# Altium schematic sheet Esquematico fonte 3.3V.SchDoc
size A4; SheetNumber: 1; SheetTotal: 1
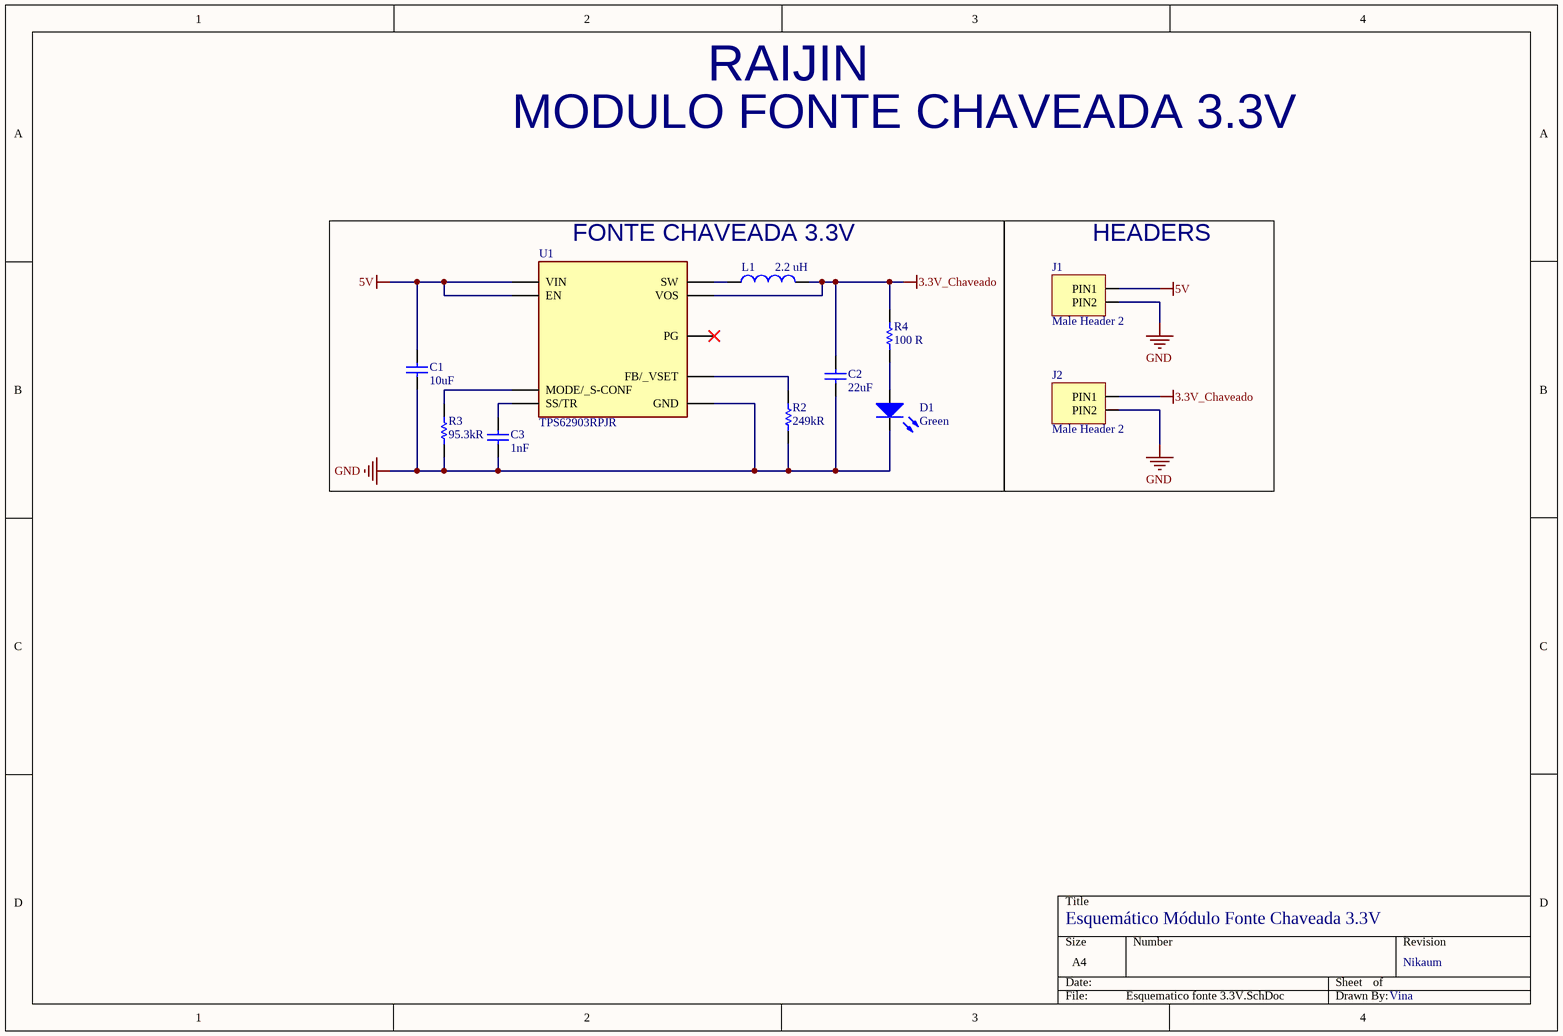
[diagram p0: Esquematico fonte 3.3V.SchDoc]

## Parts
C1  10uF  [C0805]
C2  22uF  [C0603]
C3  1nF  [C0402]
D1  Green  [LED_0603]
J1  Male Header 2  [MALE HEADER 2]
J2  Male Header 2  [MALE HEADER 2]
L1  2.2 uH  [XAL0402]
R2  249kR  [RESISTOR_0805]
R3  95.3kR  [RESISTOR_0402]
R4  100 R  [RESISTOR_0603]
U1  TPS62903RPJR  [VQFN-HR-9]

## Blocks framed on the sheet
FONTE CHAVEADA 3.3V: C1-C3 D1 L1 R2-R4 U1
HEADERS: J1 J2

## Nets
3.3V_Chaveado: C2.2 J2.PIN1 L1.2 R4.2 U1.VOS
5V: C1.2 J1.PIN1 U1.EN U1.VIN
GND: C1.1 C2.1 C3.1 D1.C J1.PIN2 J2.PIN2 R2.1 R3.1 U1.GND
NetC3_2: C3.2 U1.SS(SS/TR)
NetD1_A: D1.A R4.1
NetL1_1: L1.1 U1.SW
NetR2_2: R2.2 U1.FB(FB/_VSET)
NetR3_2: R3.2 U1.MODE(MODE/_S-CONF)

Not connected (* = marked no-connect by the designer): U1 PG*

## Notes on the sheet
- RAIJIN
- MODULO FONTE CHAVEADA 3.3V
- Esquemático Módulo Fonte Chaveada 3.3V
- Nikaum
- Vina

## Library data of the parts
C1 = C0805C106K8PACTU: CAP CER 10uF 10V 10% X5R 0805; Manufacturer: KEMET; ESR: 3mR; Library Control - Person that did the Last Update Footprint: Marcos; Supplier 1: Mouser; Part Number: C0805C106K8PACTU; Category: Cereamic Capacitor; Price: 1=0,95, 10=0,632, 100=0,397, 1000=0,322 (USD); Supplier Part Number 1: 80-C0805C106K8P; Library Ref: Capacitor; Operating Temperature: -55 C ~ 85 C; Package / Case: 0805(2012 Metric); Size / Dimension: 2 L x 1,25 W x 1,25 H; Tolerance: 10%; Value: 10uF; Voltage - Rated: 10V; Dieletric: X5R; Library Control - Checked Footprint: -; Library Control - Checked Schematic: -; Library Control - Last Project that Used: -; Library Control - Last Update: 14/07/2021 13:54; Library Control - Person that Checked Footprint: -; Library Control - Person that Checked Schematic: -; Library Control - Person that did the Last Update Schematic: Marcos; ComponentLink1Description: Datasheet; ComponentLink1URL: https://www.mouser.com/datasheet/2/212/KEM_C1006_X5R_SMD-1103249.pdf; ComponentLink2Description: Mouser Link; ComponentLink2URL: https://www.mouser.com/ProductDetail/KEMET/C0805C106K8PACTU?qs=Zpyg6gQUYs39C21BeavaKA%3D%3D
C2 = F980J226MMA: CAP TAN 22uF 6.3V 0603; Manufacturer: AVX; Tolerance: 20%; ESR: 6 Ohms; Dieletric: Tantalum; Library Control - Checked Footprint: Yes; Library Control - Person that Checked Footprint: Nikaum; Supplier 1: Mouser; Part Number: F980J226MMA; Category: Tantalum Capacitor; Price: 1 = 0,68, 10=0,478, 100=0,315 (USD); Supplier Part Number 1: 647-F980J226MMA; Library Ref: Capacitor; Operating Temperature: -55 C ~ 125 C; Package / Case: 0603 (1608 Metric); Size / Dimension: 1,60 L x 0,85 W x 0,80 H; Value: 22uF; Voltage - Rated: 6.3V; Library Control - Checked Schematic: Yes; Library Control - Last Update: 27/06/2021 23:58; Library Control - Person that Checked Schematic: Nikaum; Library Control - Person that did the Last Update Footprint: Nikaum; Library Control - Person that did the Last Update Schematic: Nikaum; ComponentLink1Description: Datasheet; ComponentLink1URL: https://br.mouser.com/datasheet/2/40/AVX_F98%20DTSH%2008_16-1158749.pdf; ComponentLink2Description: Mouser Link; ComponentLink2URL: https://br.mouser.com/ProductDetail/AVX/F980J226MMA?qs=%2Fha2pyFadujX%2FtPo6us3LKqC08nSC7LuR55MTleiyuYwEisNTuy1Qg%3D%3D
C3 = GRM155R61A102KA01D: CAP CER 1nF 10V 10% X5R 0402; Manufacturer: Murata; Voltage - Rated: 10 VDC; ESR: 1mR; Library Control - Person that did the Last Update Footprint: Marcos; Supplier 1: Mouser; Part Number: GRM155R61A102KA01D; Category: Cereamic Capacitor; Price: 1=0,10, 10=0,029, 100=0,013, 1000=0,007 (USD); Supplier Part Number 1: 81-GRM155R61A102KA1D; Library Ref: Capacitor; Operating Temperature: -55 C ~ 85 C; Package / Case: 0402 (1005 Metric); Size / Dimension: 1 L x 0,5 W x 0,5 H; Tolerance: 10%; Value: 1nF; Dieletric: X5R; Library Control - Checked Footprint: -; Library Control - Checked Schematic: -; Library Control - Last Project that Used: -; Library Control - Last Update: 14/07/2021 14:02; Library Control - Person that Checked Footprint: -; Library Control - Person that Checked Schematic: -; Library Control - Person that did the Last Update Schematic: Marcos; ComponentLink1Description: Datasheet; ComponentLink1URL: https://www.mouser.com/datasheet/2/281/1/GRM155R61A102KA01_01A-1983865.pdf; ComponentLink2Description: Mouser Link; ComponentLink2URL: https://www.mouser.com/ProductDetail/Murata-Electronics/GRM155R61A102KA01D?qs=%2Fha2pyFadugsr51Fgcs3VAawZYh8F95Q8wbZYWKEskhTBdNn7s5FlndoImKM8CcX
D1 = 150060VS75000: LED 0.072W GREEN 40MCD 0603; Manufacturer: Wurth Elektronik; Current - Forward (If): 20 mA; Voltage - Forward (Vf): 2 V; Viewing Angle: 140°; Wavelength: 570nm; Max Power Dissipation: 72mW; Max Current Rating: 100mA; Reverse Voltage:: 5V; Library Control - Last Project that Used: Diodo/Led; Library Control - Person that Checked Footprint: Stéfany (Ster); Library Control - Person that did the Last Update Schematic: Marcos; Supplier 1: Mouser; Part Number: 150060VS75000; Category: Standard LEDs - SMD; Price: 1 = 0.14, 50 = 0.133, 100 = 0.114 (USD); Package / Case: 0603; Color: Green; Operating Temperature: -40~85 °C; Luminous Intensity: 40 mcd; Library Ref: LED; Supplier Part Number 1: 710-150060VS75000; Library Control - Checked Footprint: 25/07/2021; Library Control - Checked Schematic: 25/07/2021; Library Control - Last Update: 09/09/2021 16:12; Library Control - Person that Checked Schematic: Stéfany (Ster); Library Control - Person that did the Last Update Footprint: Stéfany (Ster); ComponentLink1Description: Mouser Link; ComponentLink1URL: https://br.mouser.com/ProductDetail/Wurth-Elektronik/150060VS75000?qs=%2Fha2pyFaduhuT%2FKGSijZP0vTyJZ9U993KfsBQSxqATYhY9jnc2c09tXoMoJ3wn4L; ComponentLink2Description: Datasheet Link; ComponentLink2URL: https://br.mouser.com/datasheet/2/445/150060VS75000-1714627.pdf
J1 J2 = Male Header 2: Number of Contacts: 2; Library Control - Person that did the Last Update Schematic: Marcos; System: Connector; Library Ref: Header; Library Control - Checked Footprint: *; Library Control - Checked Schematic: *; Library Control - Last Project that Used: *; Library Control - Last Update: *; Library Control - Person that Checked Footprint: *; Library Control - Person that Checked Schematic: *; Library Control - Persont that did the Last Update Footprint: Marcos
L1 = XAL4020-222MEB: IND FIX 2.2uH Shld 20% 5.5A 38.7mOhms AECQ2; Manufacturer: Coilcraft; Part Number: XAL5030-332MEB; Inductance Frequency - Test: 1 MHz; Material - Core: Composite; Shielding: Shielded; Type: Fixed; Library Control - Checked Footprint: Yes; Library Control - Person that Checked Footprint: Nikaum; Category: Fixed Inductors; Current Rating (Amps): 5.5 A; DC Resistance (DCR): 38.7 mOhms; Frequency - Self Resonant: -; Library Ref: Inductor; Operating Temperature: - 40C ~ 125C; Package / Case: SMD/SMT; Price: 1=1,76, 10=1,75, 100=1,66 (USD); Q @ Freq: -; Size / Dimension: 4.3 mm x 4.3 mm x 2.1 mm; Supplier 1: Mouser; Supplier Part Number 1: 994-XAL4020-222MEB; Tolerance: 20 %; Value: 2.2 uH; Library Control - Last Project that Used: -; Library Control - Last Update: 07/10/2021 11:22; Library Control - Person that Checked Schematic: Nikaum; ComponentLink1Description: Datasheet; ComponentLink1URL: https://br.mouser.com/datasheet/2/597/xal50xx-270657.pdf; ComponentLink2Description: Mouser Link; ComponentLink2URL: https://br.mouser.com/ProductDetail/Coilcraft/XAL5030-332MEB?qs=VJjuEbE9QBML1BhYSWqvXA%3D%3D
R2 = CRCW0805249KFKEA: RES SMD 249K OHM 1% 1/8W 0805; Manufacturer: Vishay / Dale; Temperature Coefficient: 100 PPM / C; Power Rating: 125 mW (1/8 W); Voltage Rating: 150 V; Library Control - Checked Footprint: No; Library Control - Checked Schematic: Yes; Library Control - Person that Checked Schematic: Marcos; Library Control - Person that did the Last Update Footprint: Dalarme; Supplier 1: Mouser; Part Number: CRCW0805249KFKEA; Category: Thick Film Resistors - SMD; Price: 1=0,18, 10=0,065, 100=0,027 1000=0,012 (USD); Package / Case: 0805 (2012 Metric); Operating Temperature: - 55ºC ~ 155ºC; Value: 249kR; Tolerance: 1 %; Library Ref: Resistor; Resistor Type: Fixo; Size / Dimension: 2 mm L x  1.25 mm W x  0.45 mm H; Supplier Part Number 1: 71-CRCW0805-249K-E3; Library Control - Last Update: 21/06/21 15:40; Library Control - Person that did the Last Update Schematic: Marcos; ComponentLink1Description: Mouser Link; ComponentLink1URL: https://www.mouser.com/ProductDetail/Vishay-Dale/CRCW0805249KFKEA?qs=%2Fha2pyFaduhkDOWkOJXWlGd1WMXaUgXuAgPdkVedxkHPM1mWPj6Q%2Fw%3D%3D; ComponentLink2Description: Datasheet Link; ComponentLink2URL: https://www.mouser.com/datasheet/2/427/dcrcwe3-1762152.pdf
R3 = CRCW040295K3FKED: RES SMD 95.3K OHM 1% 1/16W 0402; Manufacturer: Vishay; Temperature Coefficient: 100 PPM / C; Power Rating: 62,5mW (1/16 W); Voltage Rating: 50V; Library Control - Person that did the last Update Schematic: Marcos; Supplier 1: Mouser; Part Number: CRCW040295K3FKED; Category: Thick Film Resistors - SMD; Price: 1 = 0,11, 10=0,04, 100=0,016, 1000=0,008 (USD); Package / Case: 0402 (1005 Metric); Operating Temperature: -55 C ~ 155 C; Value: 95.3kR; Tolerance: 1 %; Library Ref: Resistor; Resistor Type: Fixo; Size / Dimension: 1 L x 0,5 W x 0,35 H; Supplier Part Number 1: 71-CRCW0402-95.3K-E3; Library Control - Checked Footprint: *; Library Control - Checked Schematic: *; Library Control - Last Project that Used: *; Library Control - Last Update: 13/07/21 22:10; Library Control - Person that Checked Footprint: *; Library Control - Person that Checked Schematic: *; Library Control - Person that did the last Update Footprint: Marcos; ComponentLink1Description: Mouser Link; ComponentLink1URL: https://www.mouser.com/ProductDetail/Vishay-Dale/CRCW040295K3FKED?qs=lxmYmG9KtX%2FBpXlMXoZLjA%3D%3D; ComponentLink2Description: Datasheet Link; ComponentLink2URL: https://www.mouser.com/datasheet/2/427/dcrcwe3-1762152.pdf
R4 = RC0603FR-10100RL: RES SMD 100 OHM 1% 1/10W 0603; Manufacturer: Yageo; Temperature Coefficient: 100 PPM / C; Power Rating: 100mW (1/10W); Voltage Rating: 75 V; Library Control - Checked Footprint: Yes; Library Control - Person that Checked Footprint: Nikaum; Library Control - Person that did the Last Update Footprint: Nicolas; Supplier 1: Mouser; Part Number: RC0603FR-10100RL; Category: Thick Film Resistors - SMD; Price: 1 = 0,10, 10 = 0,018, 100 = 0,006 (USD); Package / Case: 0603 (1608 metric); Operating Temperature: - 55 C~155 C; Value: 100 R; Tolerance: 1 %; Library Ref: Resistor; Resistor Type: Fixo; Size / Dimension: 1,60 L x 0,80 W x 0,45 H; Supplier Part Number 1: 603-RC0603FR-10100RL; Library Control - Checked Schematic: Yes; Library Control - Last Update: 27/06/2021 21:11; Library Control - Person that Checked Schematic: Nikaum; Library Control - Person that did the Last Update Schematic: Nikaum; ComponentLink1Description: Mouser Link; ComponentLink1URL: https://br.mouser.com/ProductDetail/Yageo/RC0603FR-10100RL/?qs=EiqXWrxQq62RG9T9SdQg0g==; ComponentLink2Description: Datasheet Link; ComponentLink2URL: https://br.mouser.com/datasheet/2/447/Yageo_03_18_2021_PYu_RC_Group_51_RoHS_L_11-2199992.pdf
U1 = TPS62903RPJR: IC REG SWITCHING 3A 0.4V to 5.5V; Manufacturer: Texas Instruments; Output Type: Regulated; Number of Regulators: 1; Voltage- Input (Max): 17V; Library Control - Person that did the Last Update Footprint: Marcos; Voltage - Input (Min): 3V; Frequency - Switching: 1MHz to 2.5MHz; Supplier 1: Mouser; Part Number: TPS62903RPJR; Library Ref: Voltage Regulator; Category: Switching Regulator; Price: 1=2.03 , 10=1,83 , 100=1,47 , 500=1,21 , 1000=1,01 (USD); Package/Case: VQFN-HR-9; Operating Temperature: -40~150 C; Max power Dissipation: -; Voltage- Output (Min/Fixed): 0.4V; Supplier Part Number 1: 595-TPS62903RPJR; Voltage - Dropout (Max): -; Library Control - Checked Footprint: *; Library Control - Checked Schematic: *; Library Control - Last Project that Used: *; Library Control - Last Update: *; Library Control - Person that Checked Footprint: *; Library Control - Person that Checked Schematic: *; Library Control - Person that did the Last Update Schematic: Marcos; Voltage Output (Max): 5.5V; Current - Output: 3A; Current - Operating Supply: -; ComponentLink1Description: Mouser Link; ComponentLink1URL: https://www.mouser.com/ProductDetail/Texas-Instruments/TPS62903RPJR?qs=%2Fha2pyFadujoz9dD2iWmxEIG8wILTQB4UFbtSuHjz9jGVhTZ6FLd7w%3D%3D; ComponentLink2Description: Datasheet Link; ComponentLink2URL: https://www.ti.com/lit/ds/symlink/tps62903.pdf?ts=1626116449588&ref_url=https%253A%252F%252Fwww.ti.com%252Fproduct%252FTPS62903